# EAGLE schematic Led_Driver_90_B1 (EAGLE 6.4)
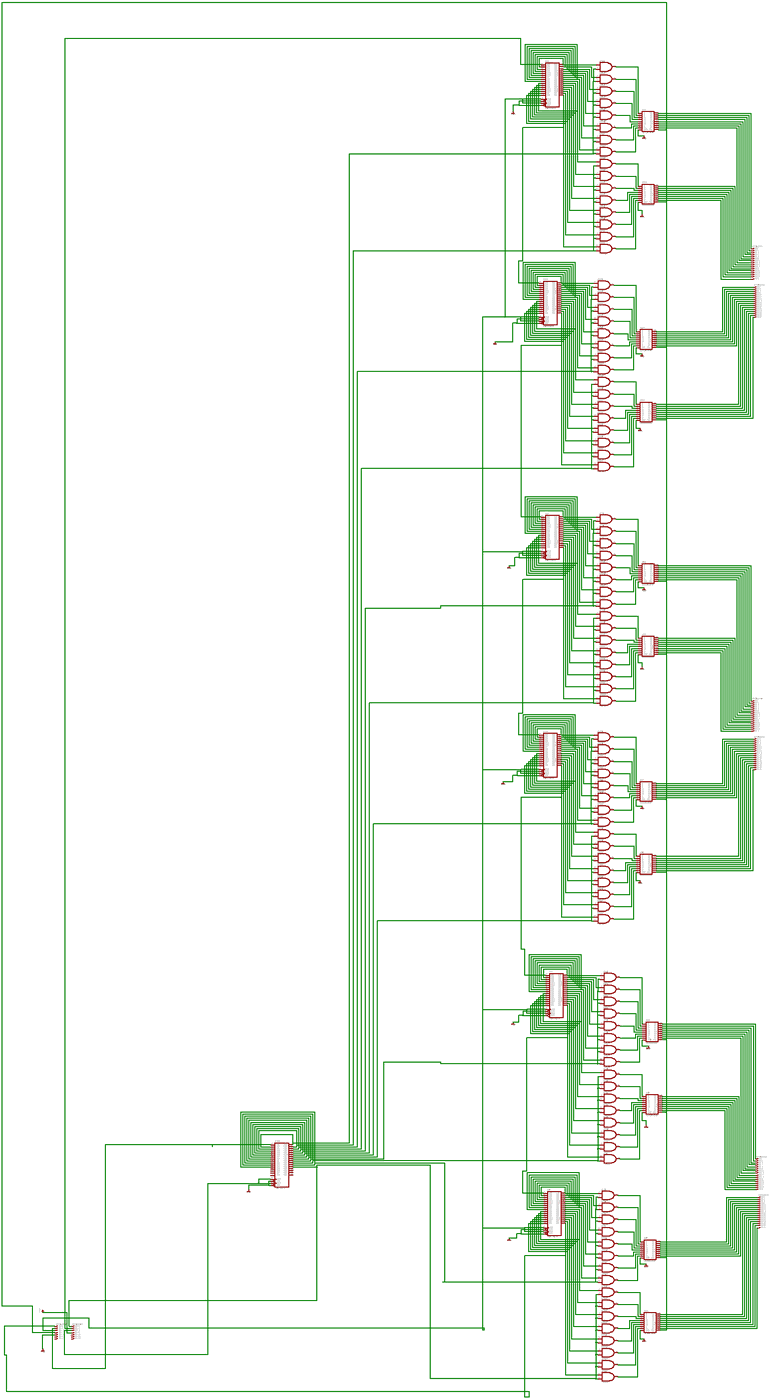
[diagram p0: schematic, sheet 1, overview]
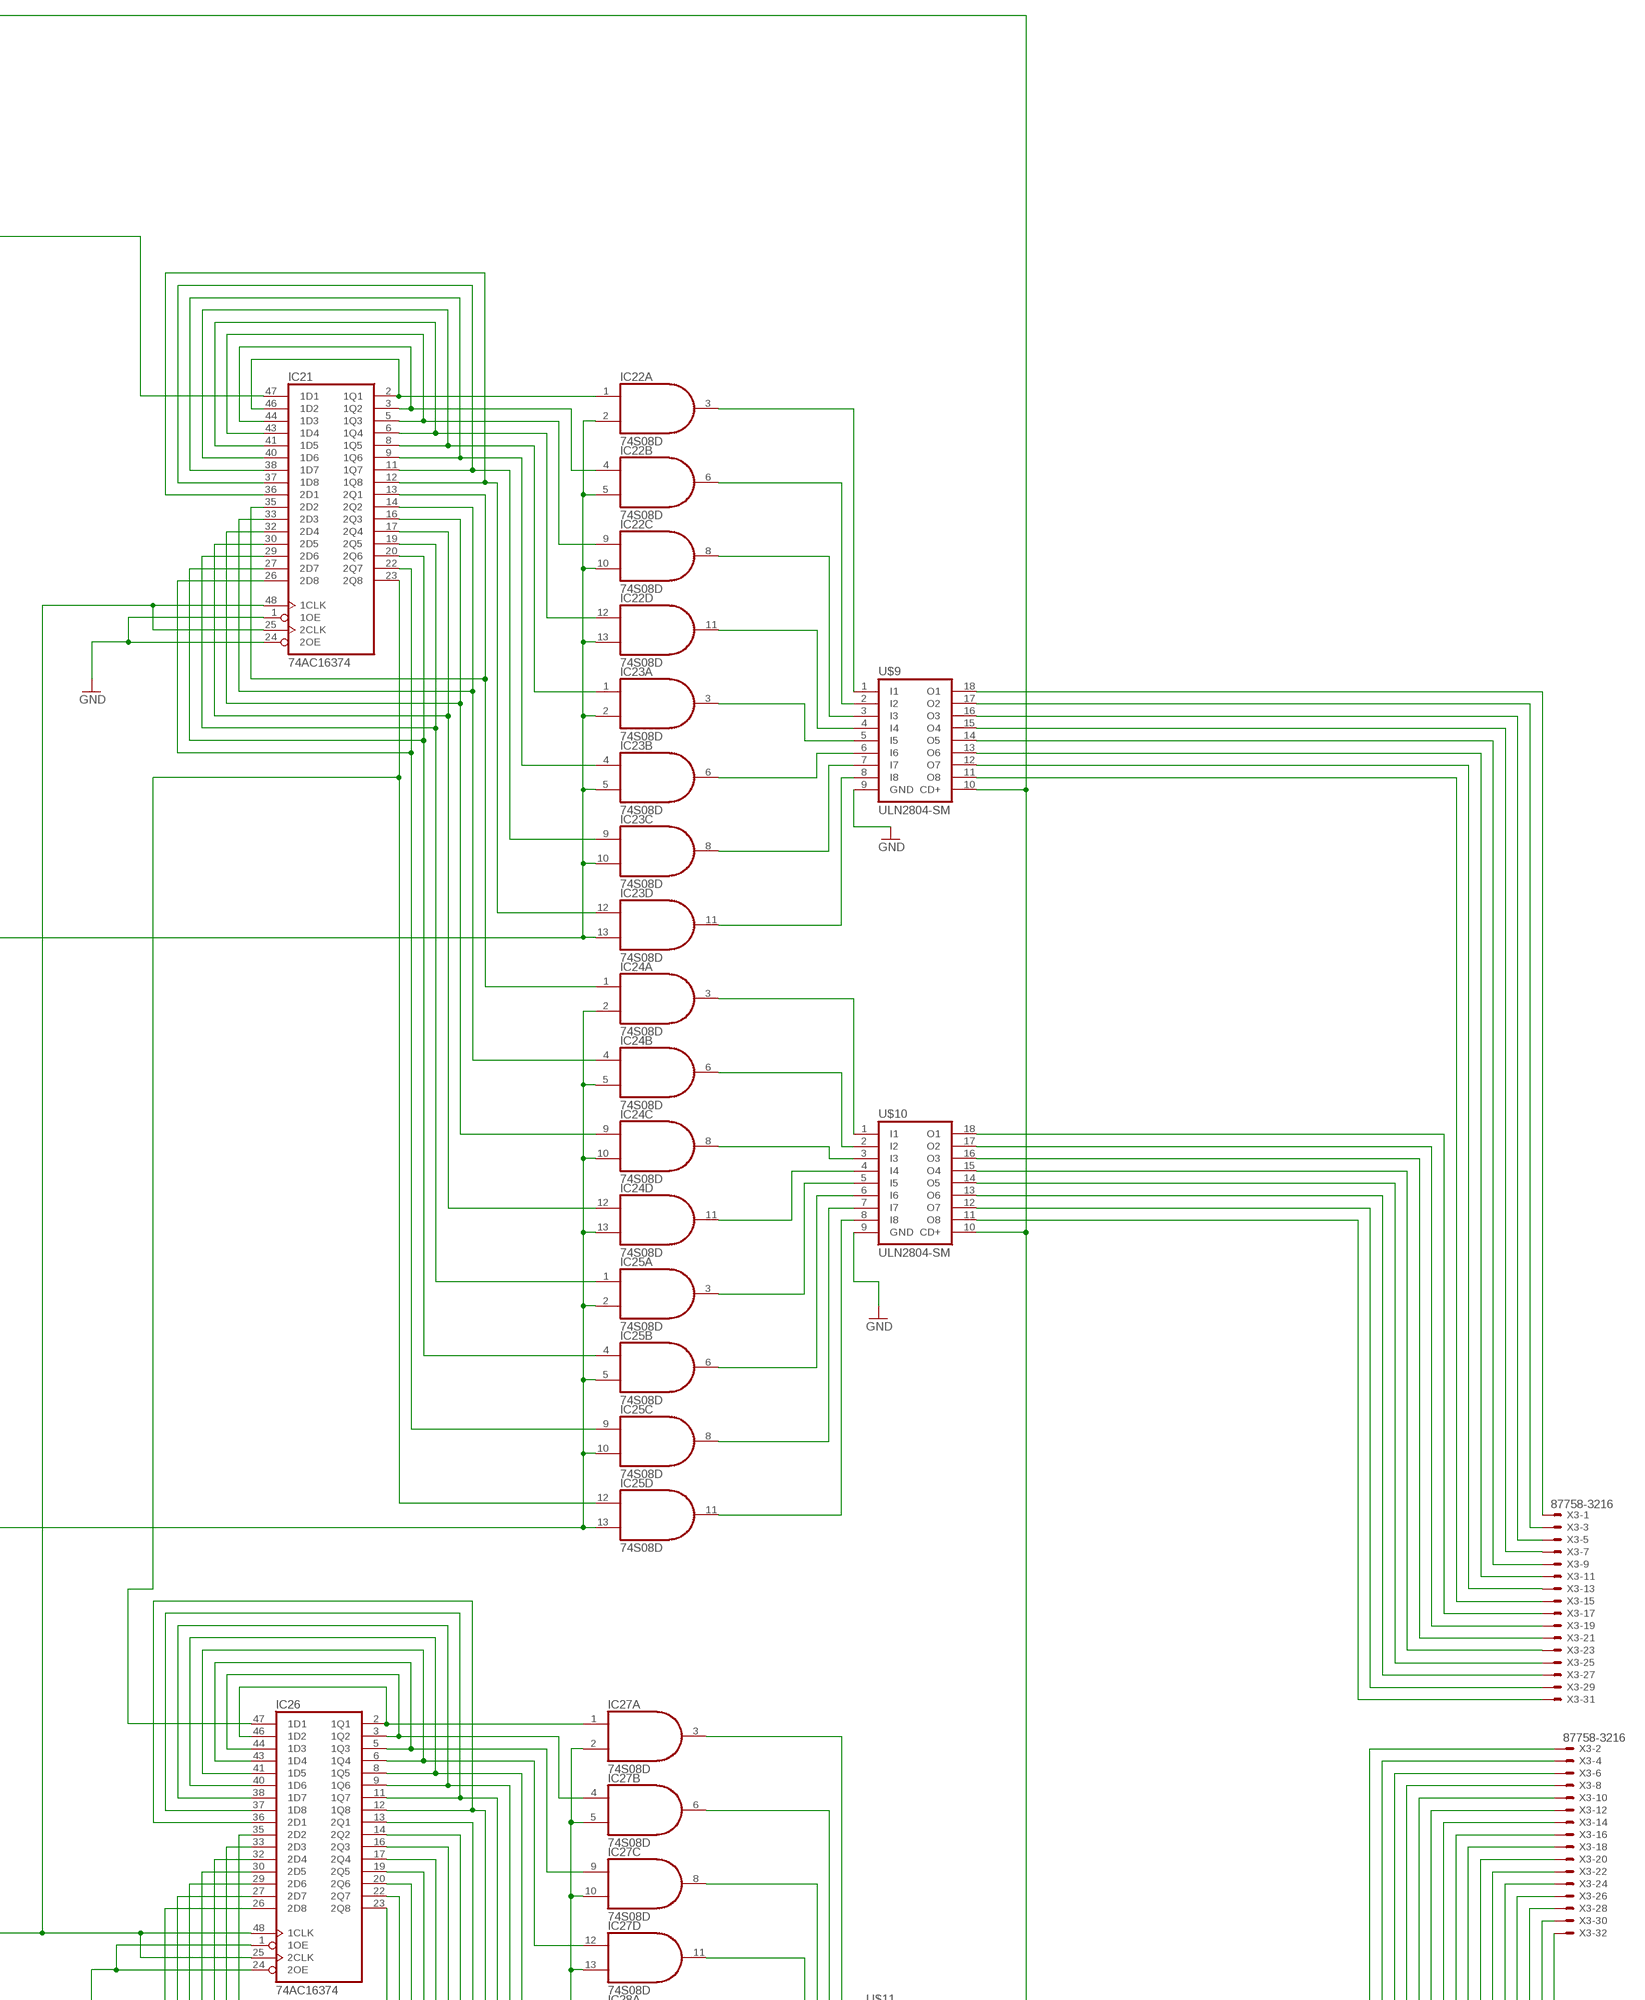
[diagram p1: schematic, sheet 1, part 1 of 9]
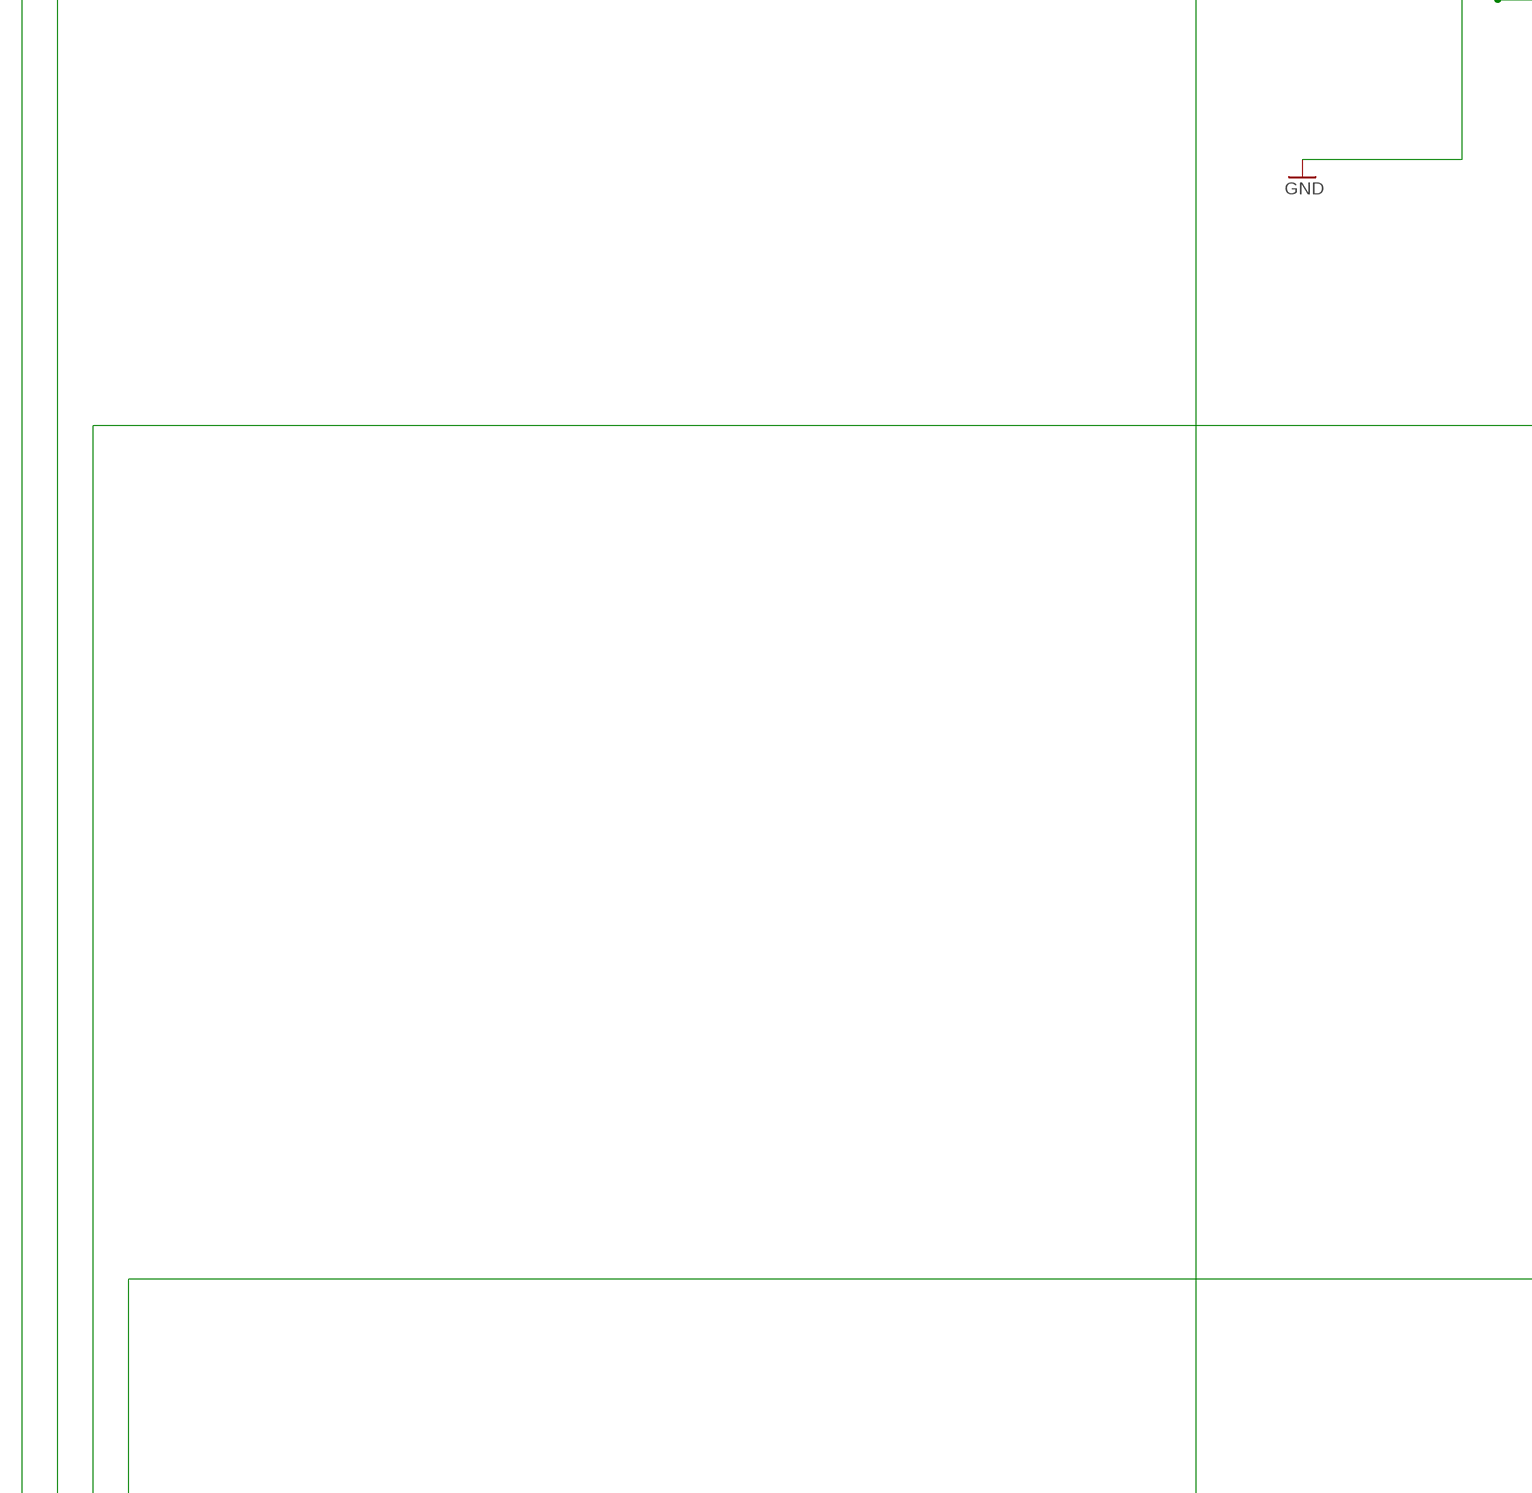
[diagram p2: schematic, sheet 1, part 2 of 9]
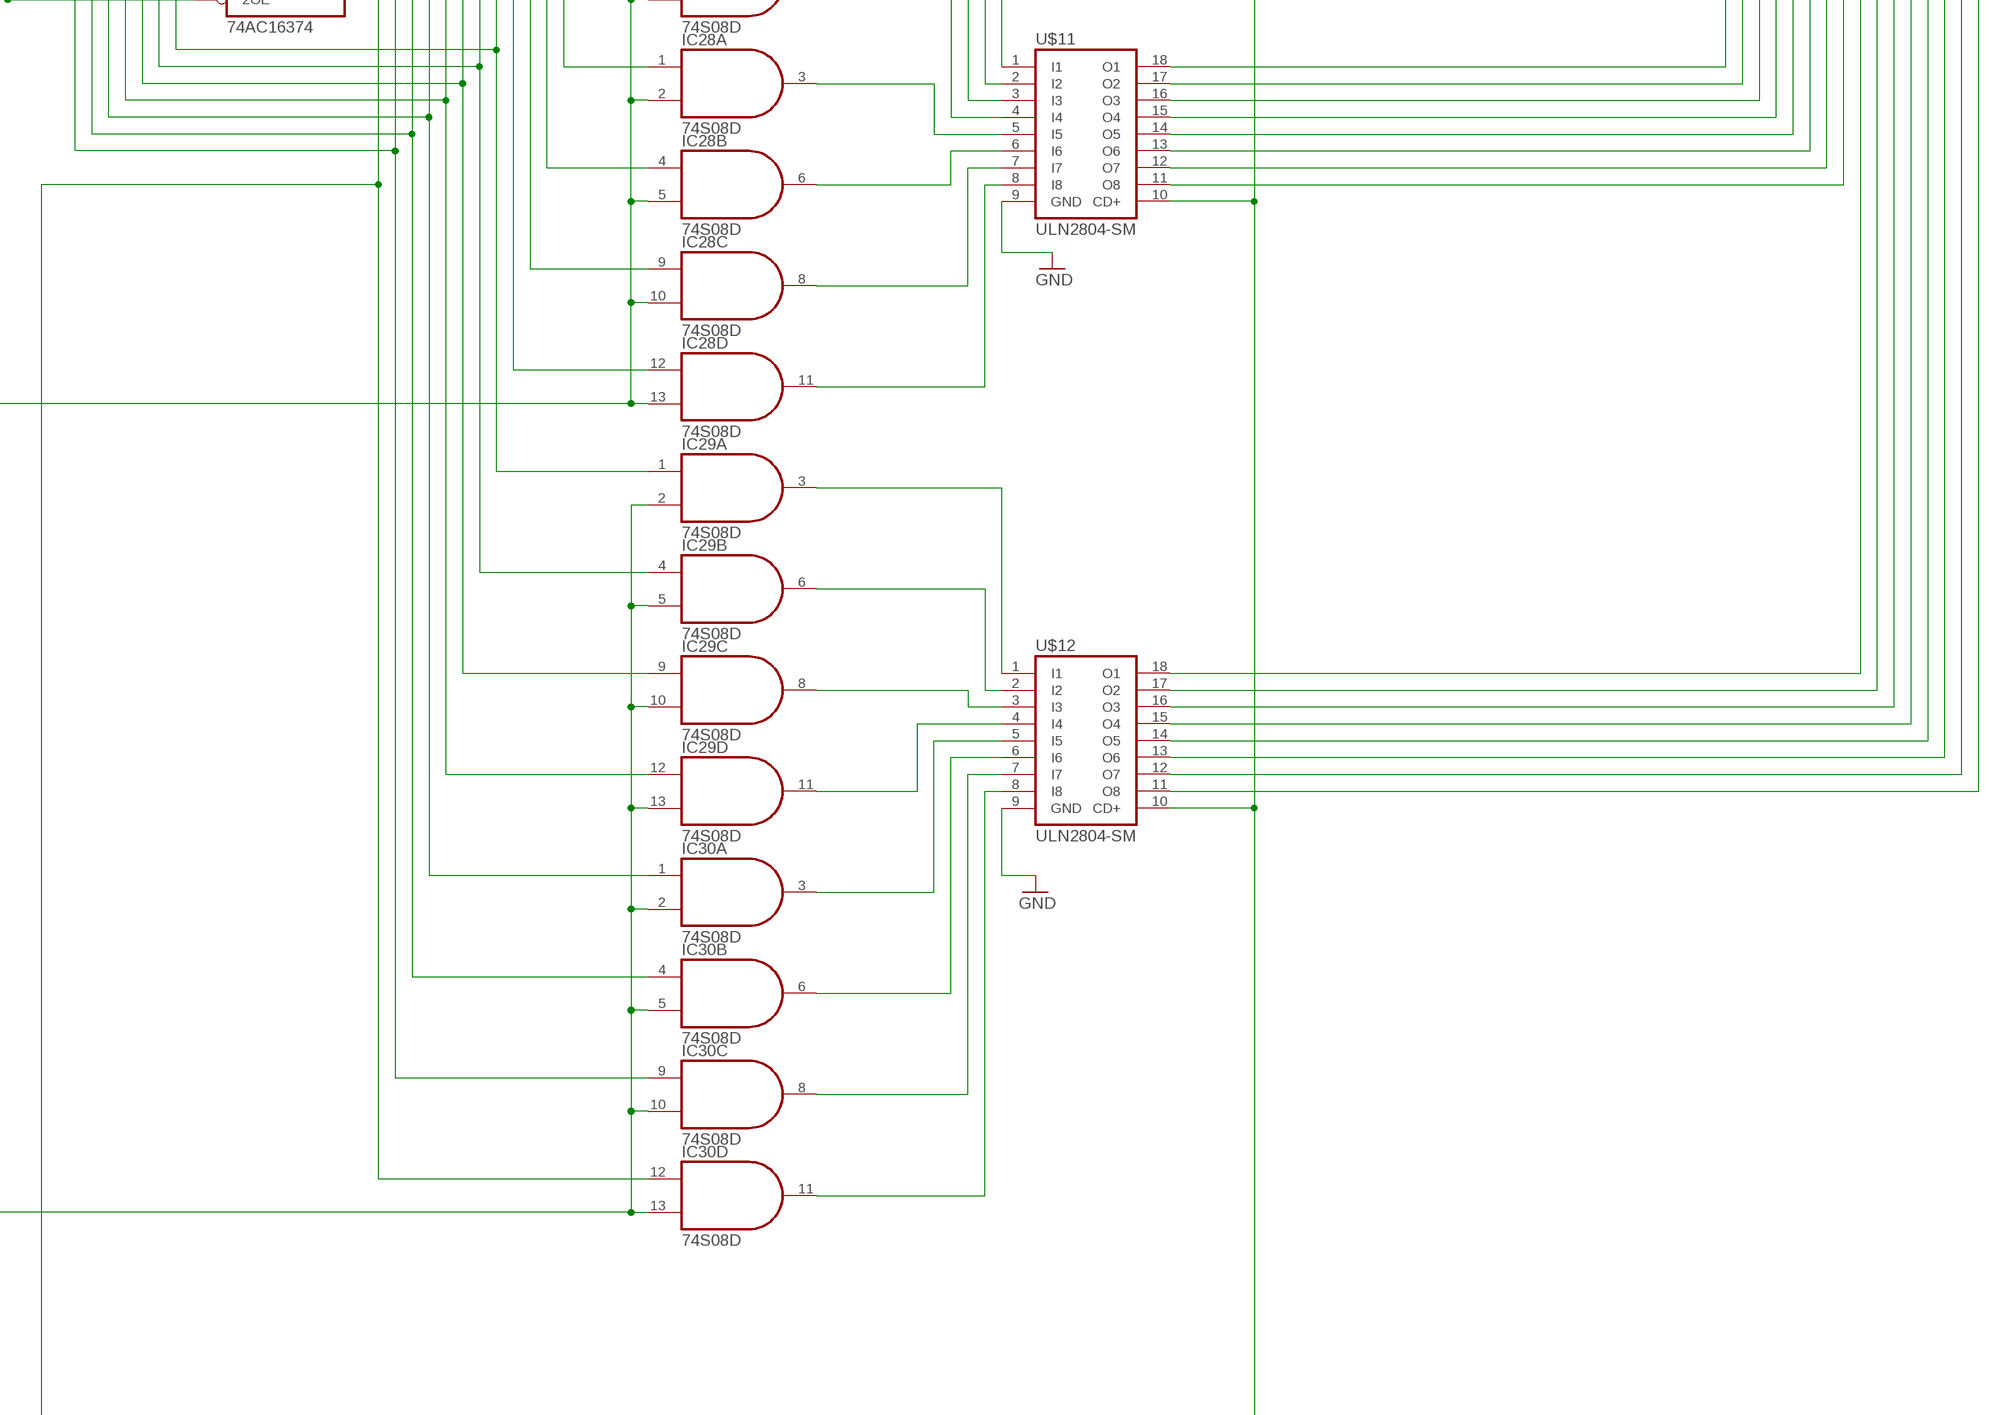
[diagram p3: schematic, sheet 1, part 3 of 9]
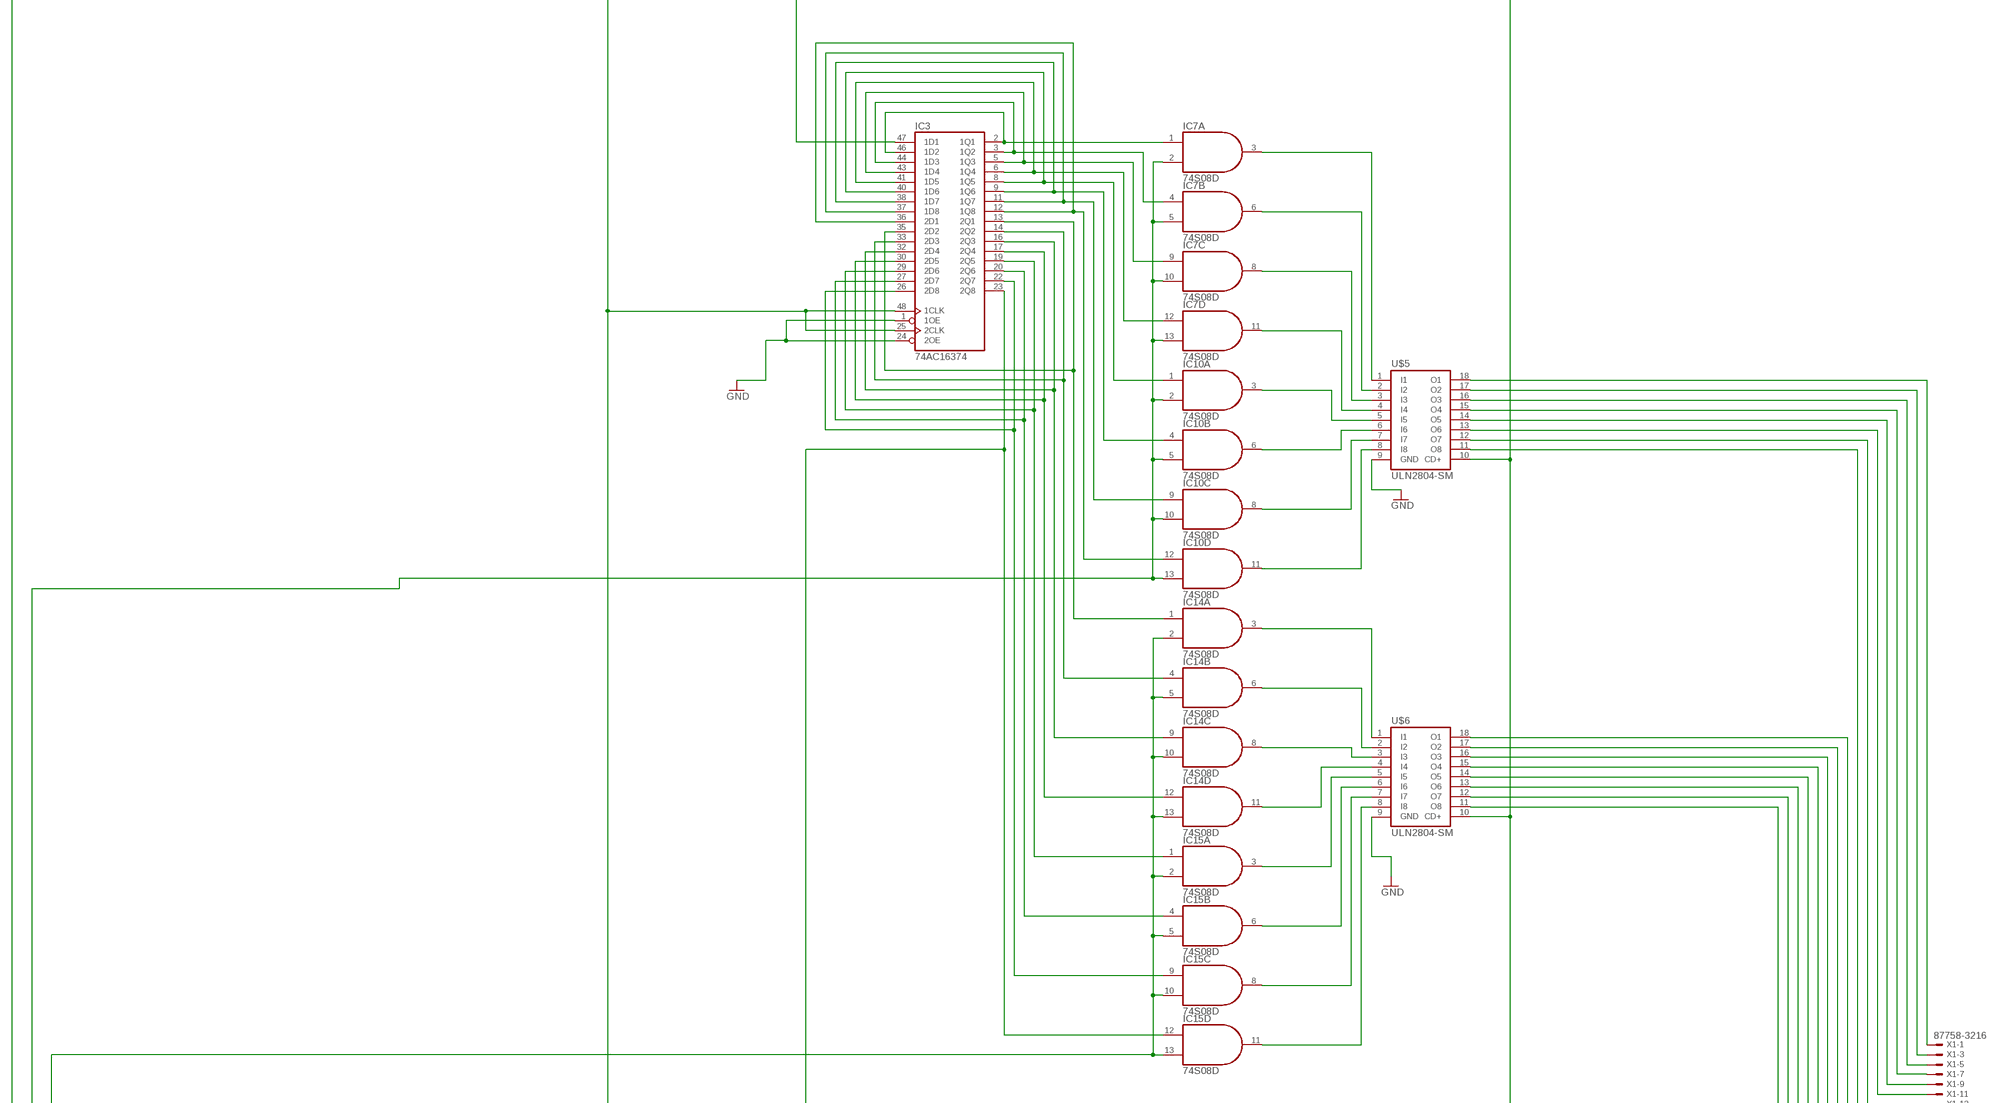
[diagram p4: schematic, sheet 1, part 4 of 9]
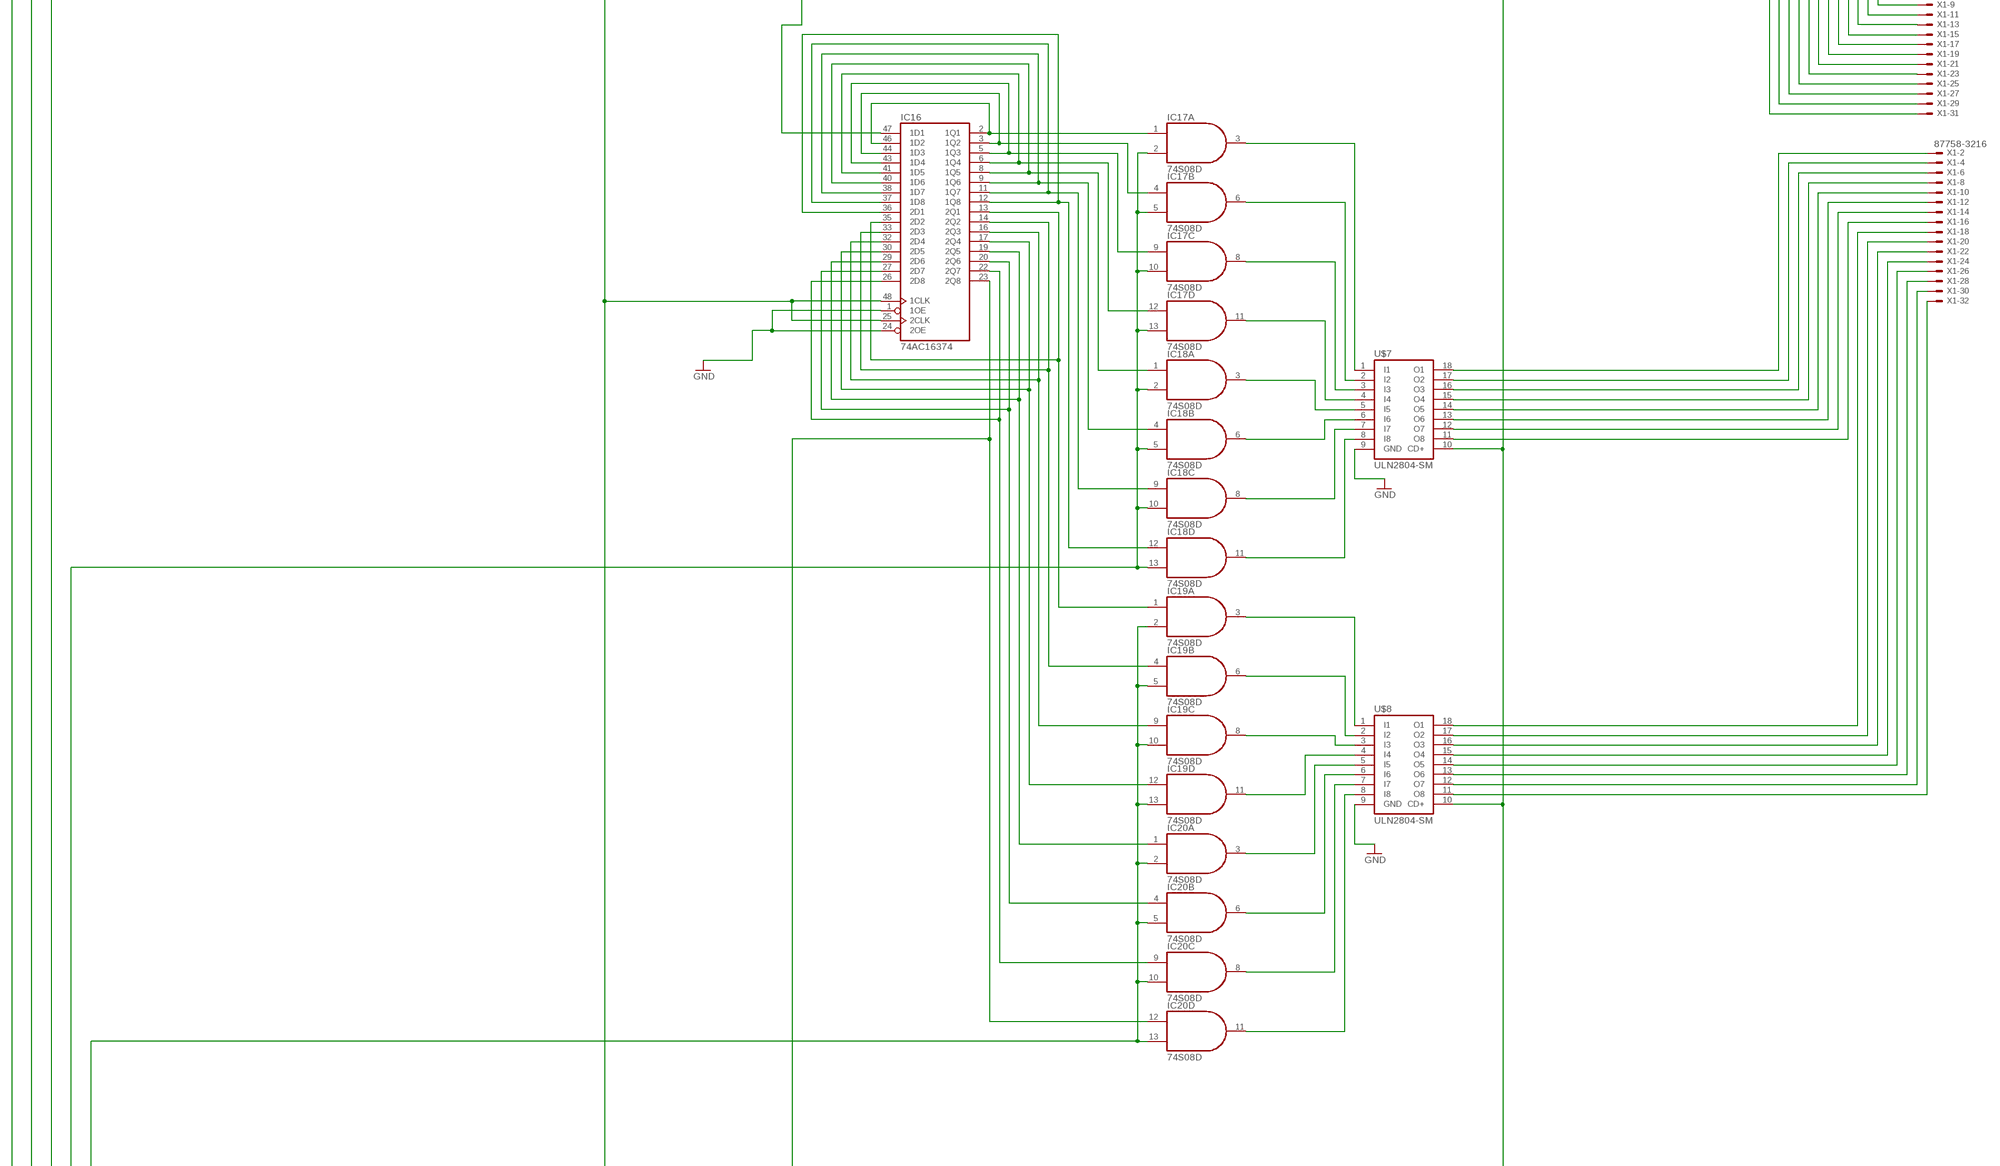
[diagram p5: schematic, sheet 1, part 5 of 9]
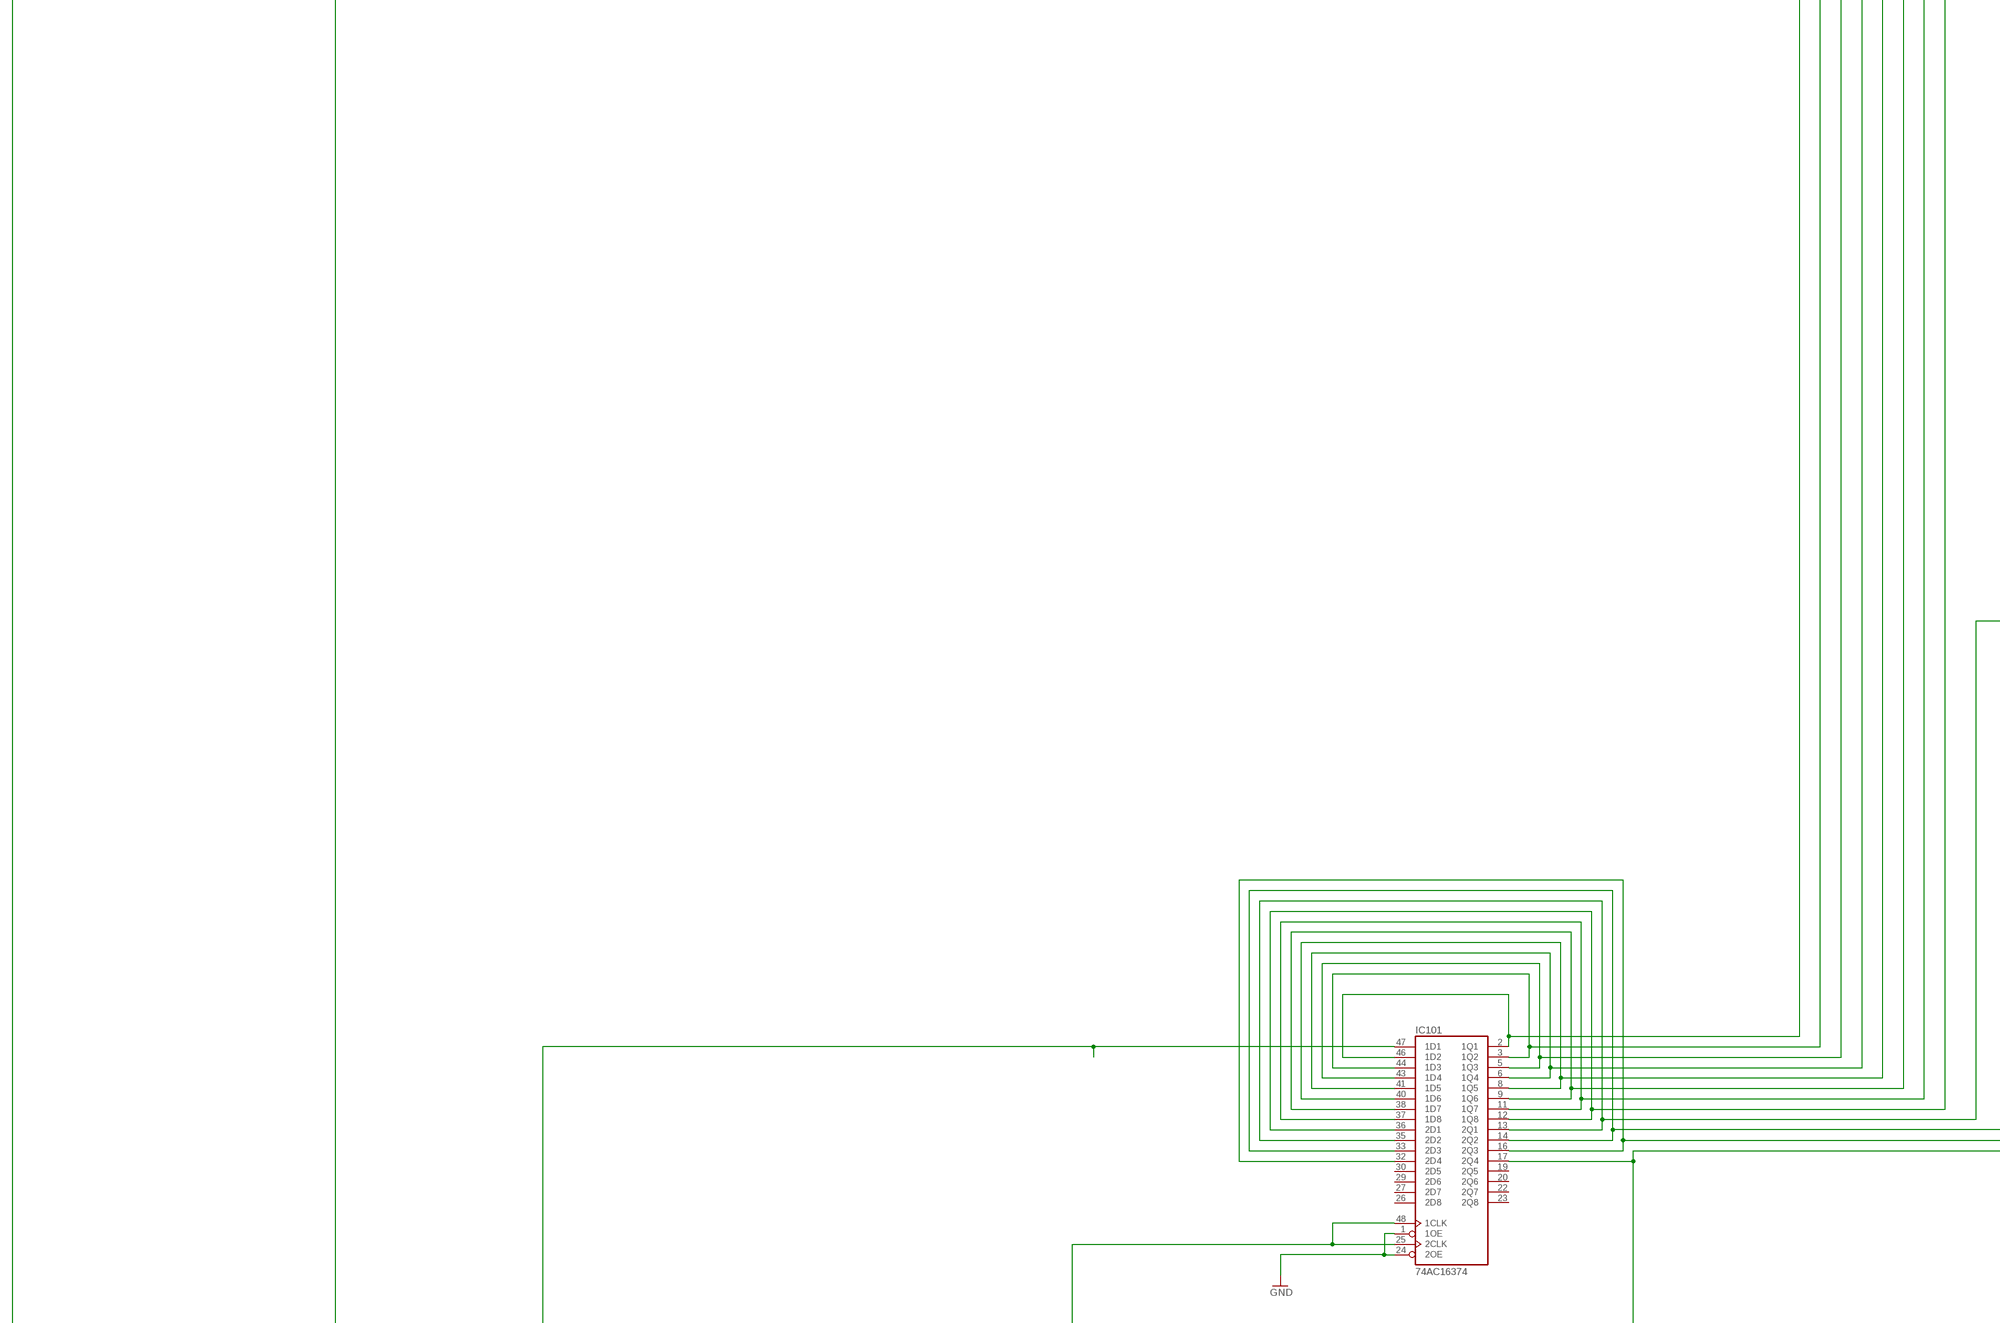
[diagram p6: schematic, sheet 1, part 6 of 9]
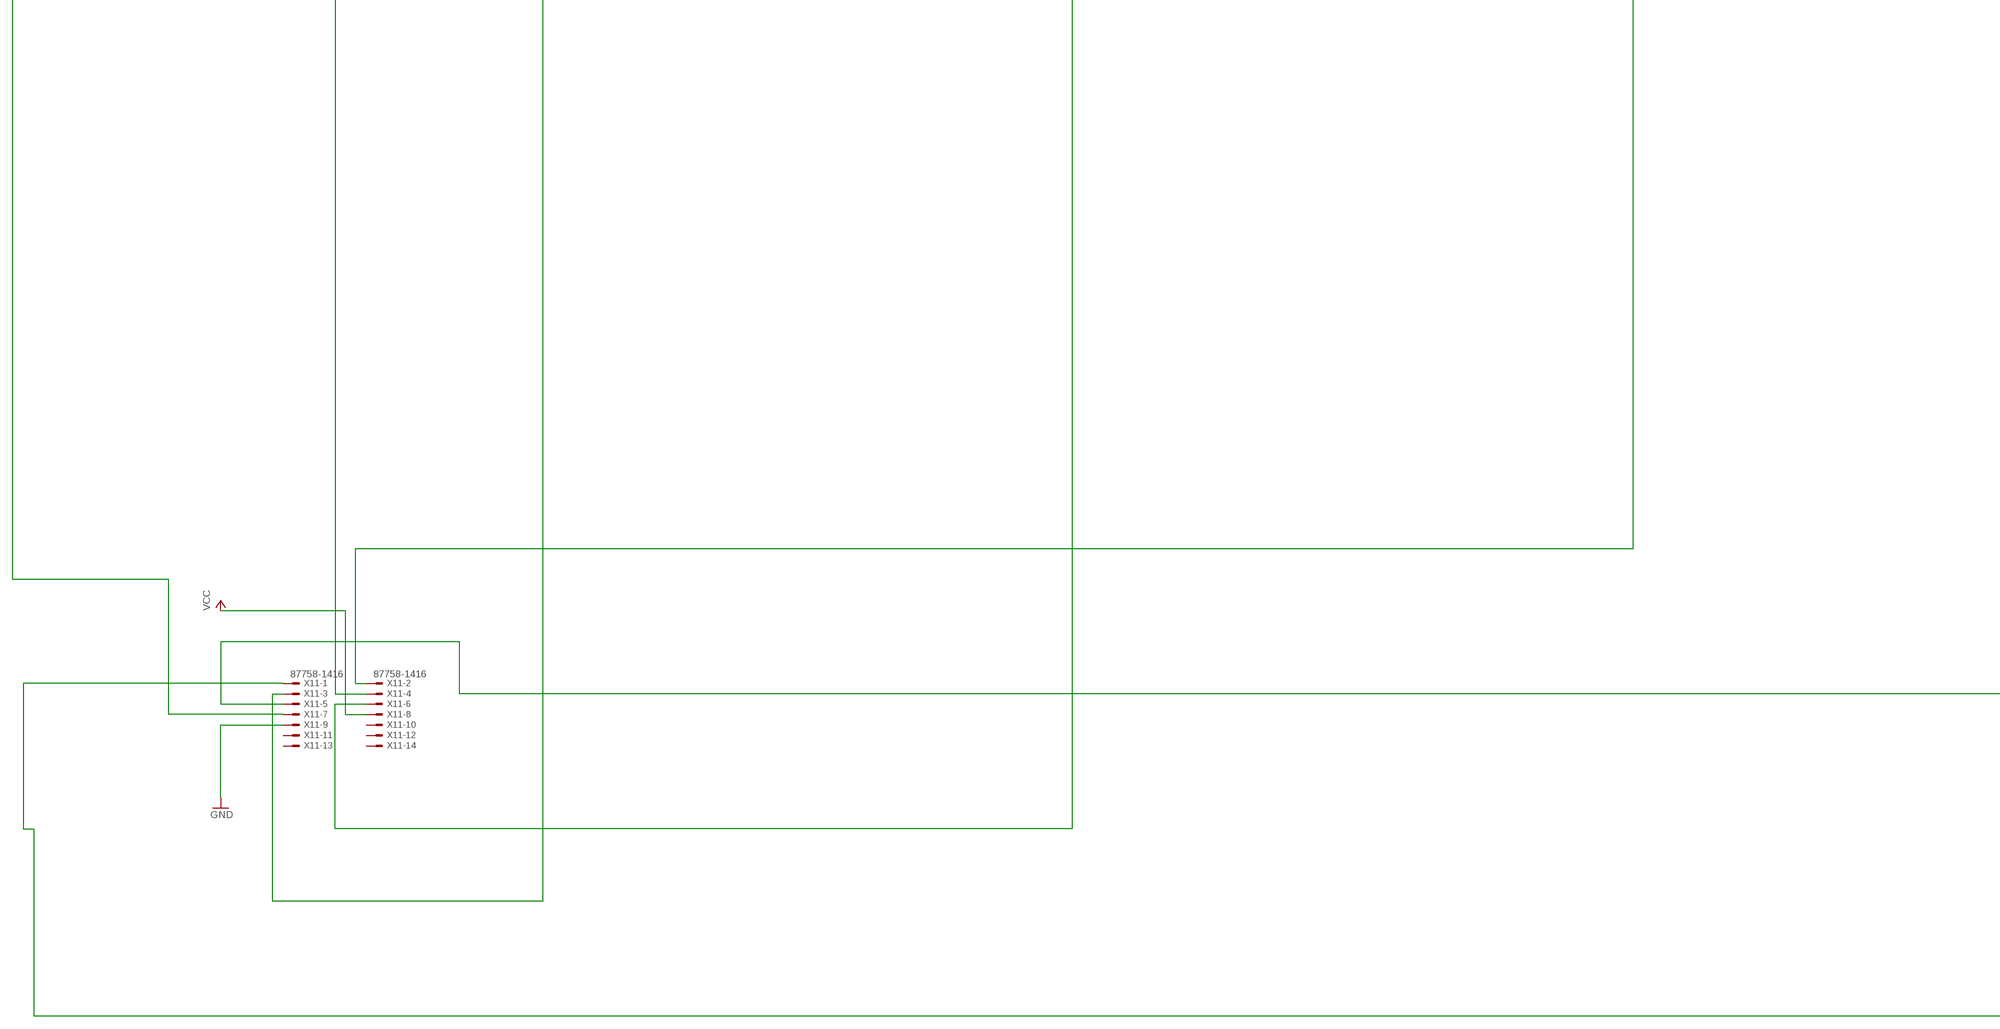
[diagram p7: schematic, sheet 1, part 7 of 9]
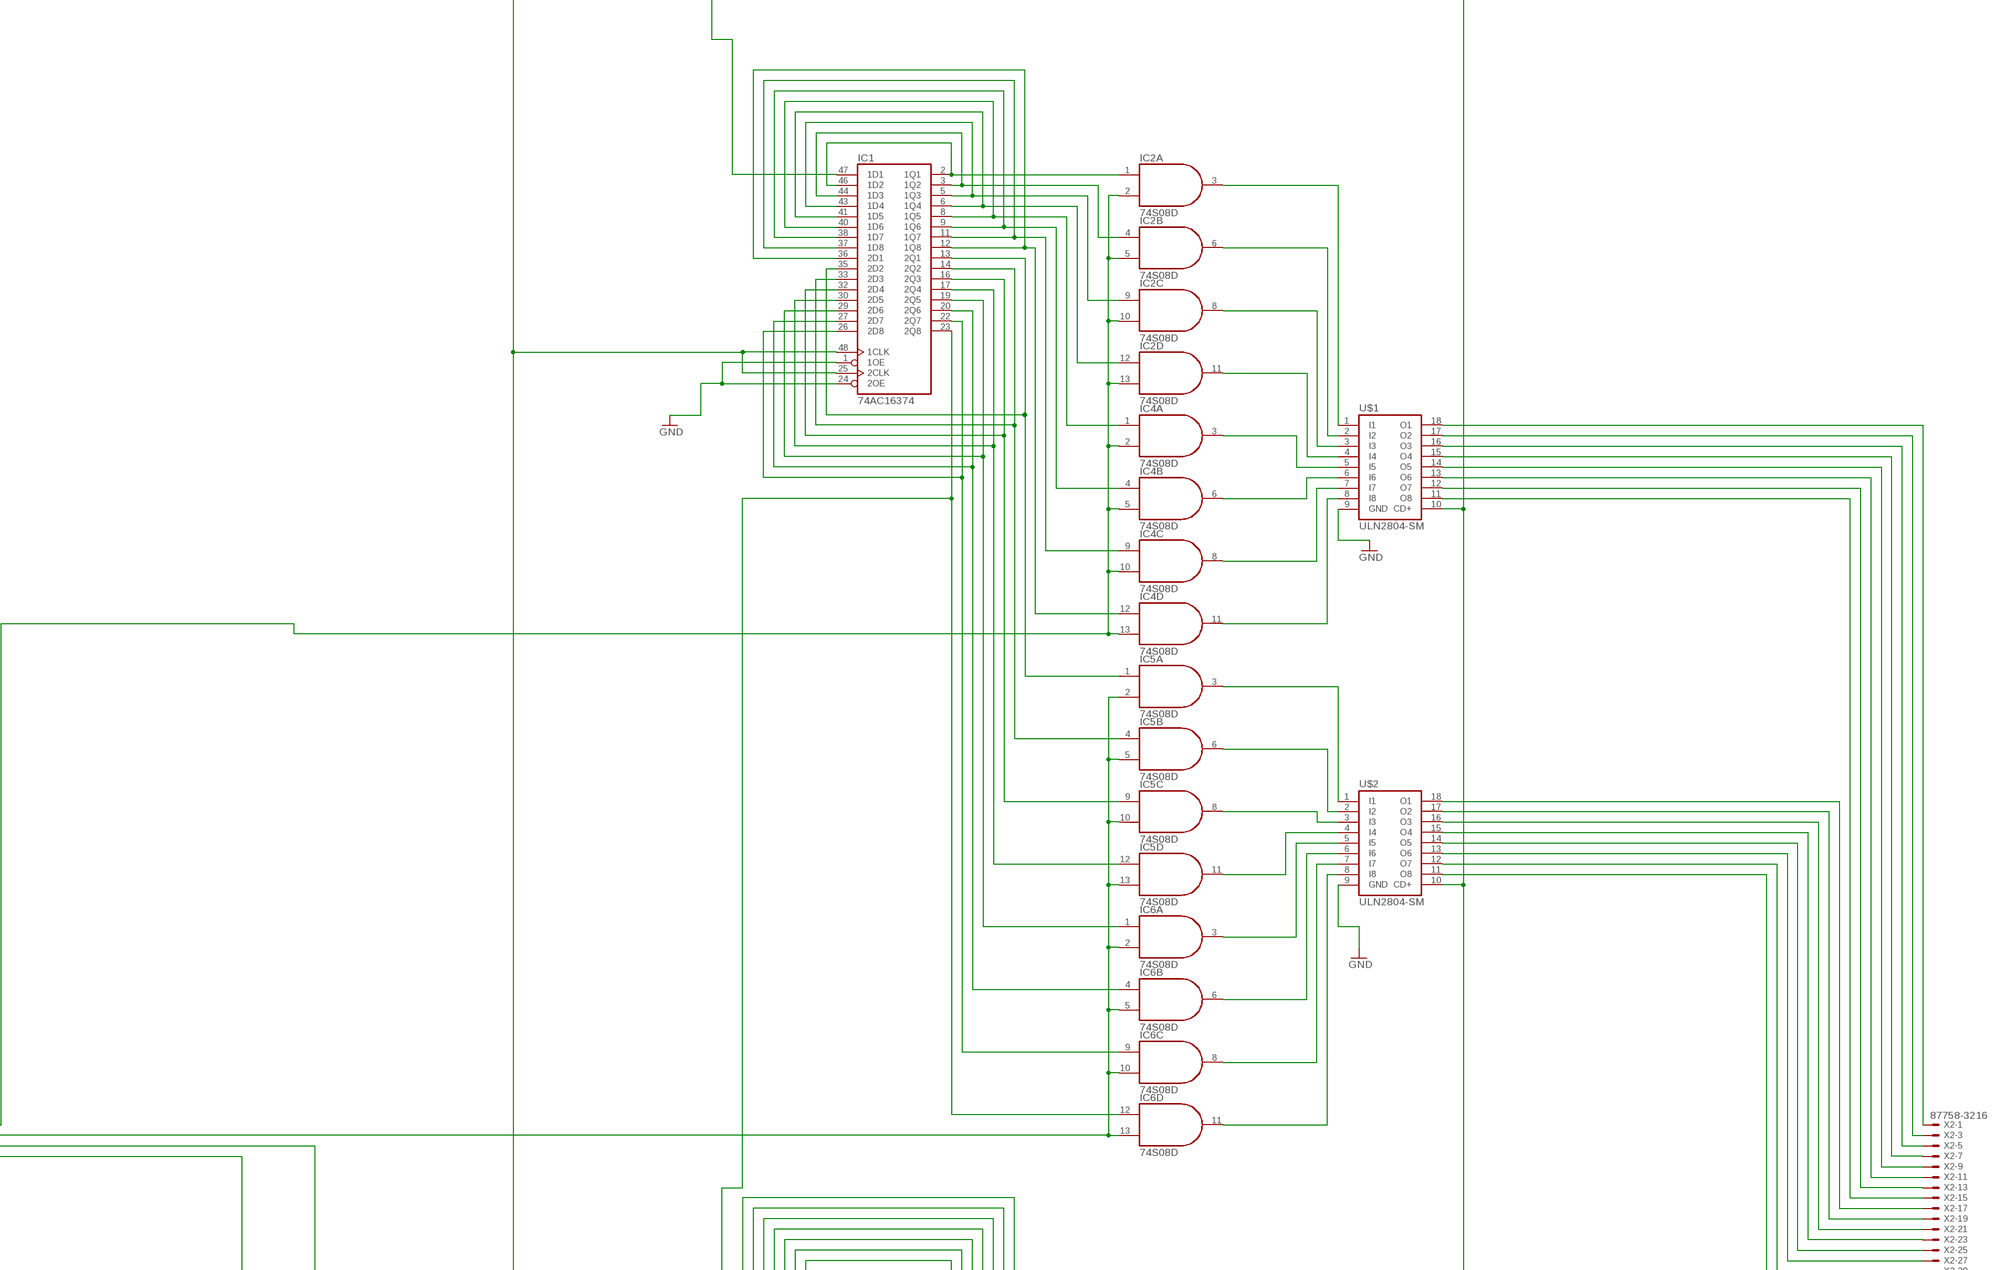
[diagram p8: schematic, sheet 1, part 8 of 9]
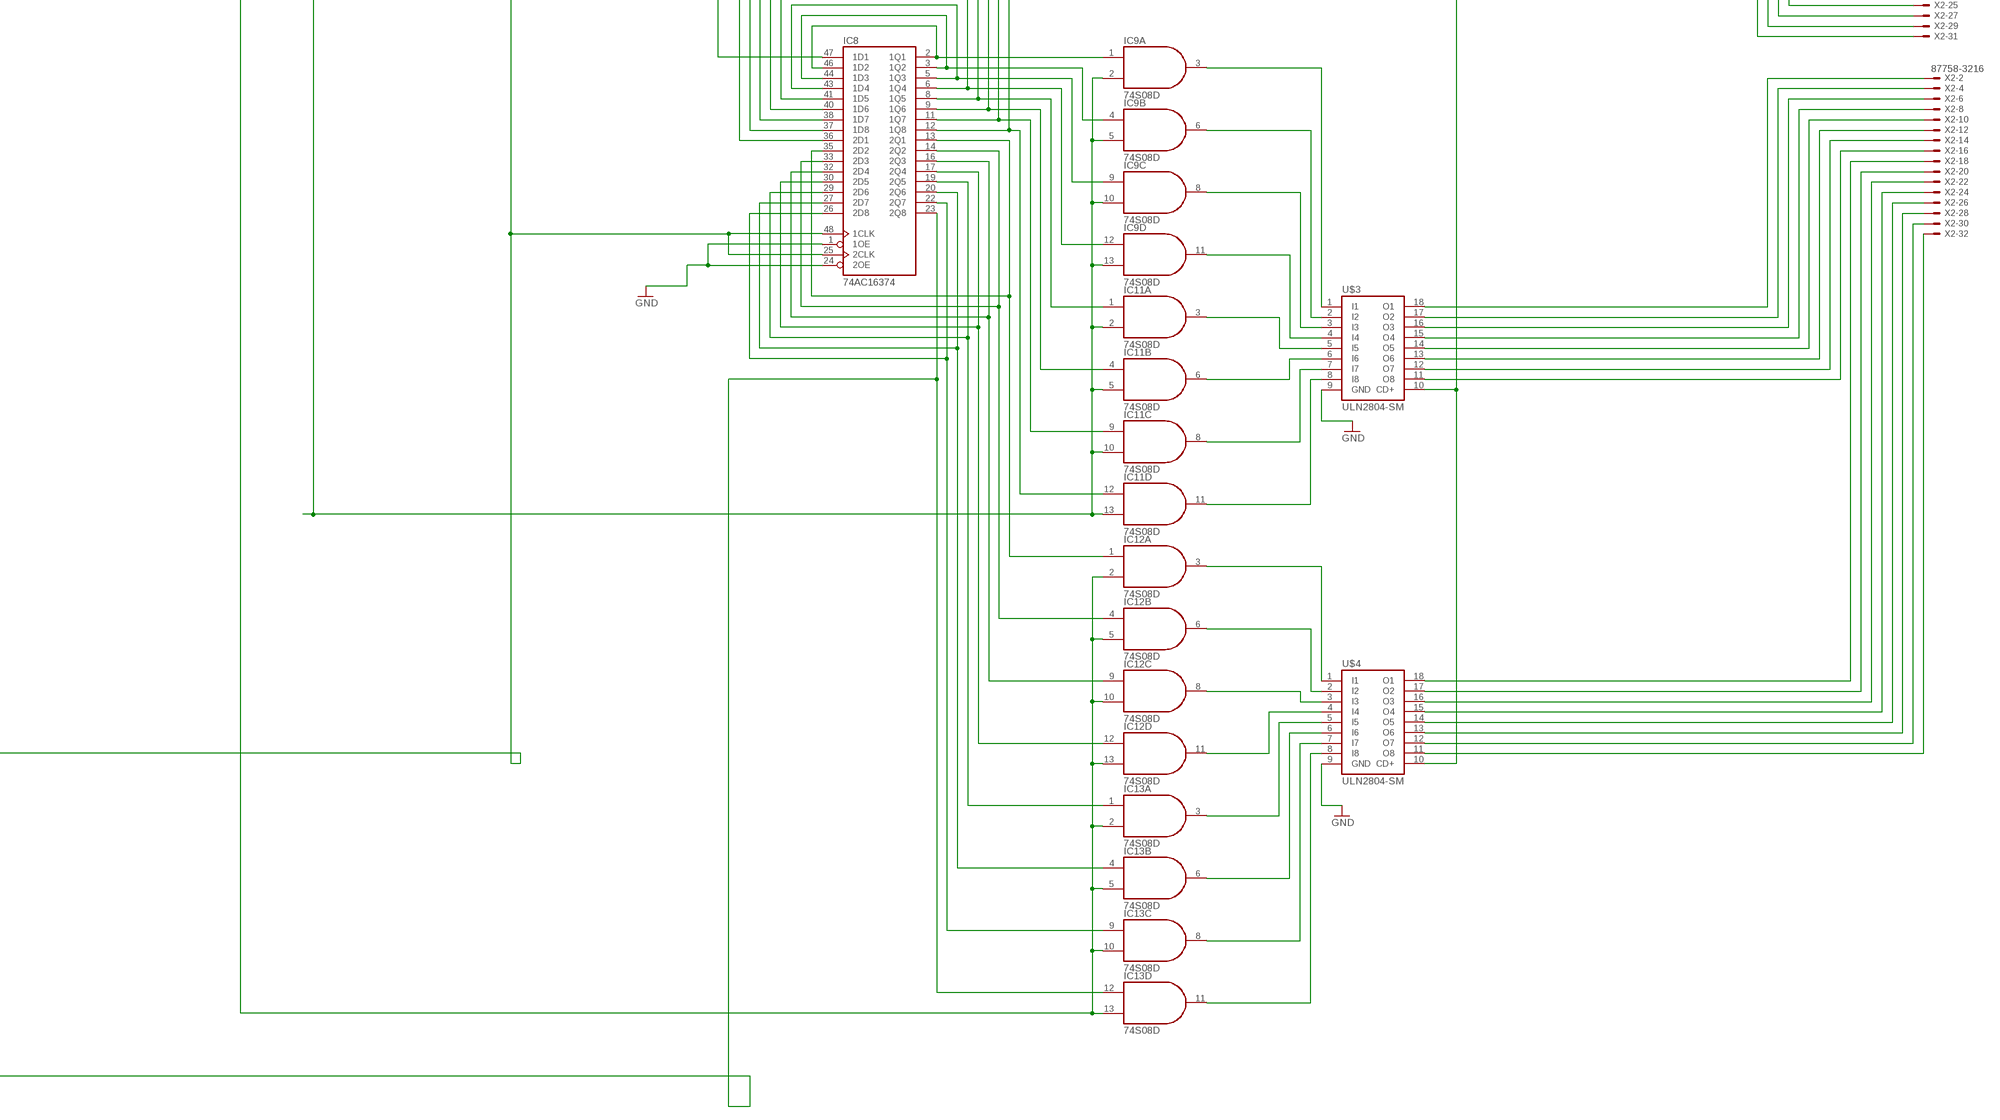
[diagram p9: schematic, sheet 1, part 9 of 9]

## Parts
IC1  74AC16374  [SSOP48DL]
IC2  74S08D  [SO14]
IC3  74AC16374  [SSOP48DL]
IC4  74S08D  [SO14]
IC5  74S08D  [SO14]
IC6  74S08D  [SO14]
IC7  74S08D  [SO14]
IC8  74AC16374  [SSOP48DL]
IC9  74S08D  [SO14]
IC10  74S08D  [SO14]
IC11  74S08D  [SO14]
IC12  74S08D  [SO14]
IC13  74S08D  [SO14]
IC14  74S08D  [SO14]
IC15  74S08D  [SO14]
IC16  74AC16374  [SSOP48DL]
IC17  74S08D  [SO14]
IC18  74S08D  [SO14]
IC19  74S08D  [SO14]
IC20  74S08D  [SO14]
IC21  74AC16374  [SSOP48DL]
IC22  74S08D  [SO14]
IC23  74S08D  [SO14]
IC24  74S08D  [SO14]
IC25  74S08D  [SO14]
IC26  74AC16374  [SSOP48DL]
IC27  74S08D  [SO14]
IC28  74S08D  [SO14]
IC29  74S08D  [SO14]
IC30  74S08D  [SO14]
IC101  74AC16374  [SSOP48DL]
U$1  ULN2804-SM  [SOP-18]
U$2  ULN2804-SM  [SOP-18]
U$3  ULN2804-SM  [SOP-18]
U$4  ULN2804-SM  [SOP-18]
U$5  ULN2804-SM  [SOP-18]
U$6  ULN2804-SM  [SOP-18]
U$7  ULN2804-SM  [SOP-18]
U$8  ULN2804-SM  [SOP-18]
U$9  ULN2804-SM  [SOP-18]
U$10  ULN2804-SM  [SOP-18]
U$11  ULN2804-SM  [SOP-18]
U$12  ULN2804-SM  [SOP-18]
X1  87758-3216  [87758-3216]
X2  87758-3216  [87758-3216]
X3  87758-3216  [87758-3216]
X11  87758-1416  [87758-1416]

## Nets
GND: IC1.1(1OE) IC1.24(2OE) IC3.1(1OE) IC3.24(2OE) IC8.1(1OE) IC8.24(2OE) IC16.1(1OE) IC16.24(2OE) IC21.1(1OE) IC21.24(2OE) IC26.1(1OE) IC26.24(2OE) IC101.1(1OE) IC101.24(2OE) U$1.9(GND) U$2.9(GND) U$3.9(GND) U$4.9(GND) U$5.9(GND) U$6.9(GND) U$7.9(GND) U$8.9(GND) U$9.9(GND) U$10.9(GND) U$11.9(GND) U$12.9(GND) X11.9
N$2: IC1.2(1Q1) IC1.46(1D2) IC2.1(A:I0)
N$3: IC1.3(1Q2) IC1.44(1D3) IC2.4(B:I0)
N$4: IC1.5(1Q3) IC1.43(1D4) IC2.9(C:I0)
N$5: IC1.6(1Q4) IC1.41(1D5) IC2.12(D:I0)
N$6: IC1.8(1Q5) IC1.40(1D6) IC4.1(A:I0)
N$7: IC1.9(1Q6) IC1.38(1D7) IC4.4(B:I0)
N$8: IC1.11(1Q7) IC1.37(1D8) IC4.9(C:I0)
N$9: IC1.12(1Q8) IC1.36(2D1) IC4.12(D:I0)
N$10: IC1.13(2Q1) IC1.35(2D2) IC5.1(A:I0)
N$11: IC1.14(2Q2) IC1.33(2D3) IC5.4(B:I0)
N$12: IC1.16(2Q3) IC1.32(2D4) IC5.9(C:I0)
N$13: IC1.17(2Q4) IC1.30(2D5) IC5.12(D:I0)
N$14: IC1.19(2Q5) IC1.29(2D6) IC6.1(A:I0)
N$15: IC1.20(2Q6) IC1.27(2D7) IC6.4(B:I0)
N$16: IC1.22(2Q7) IC1.26(2D8) IC6.9(C:I0)
N$17: U$1.18(O1) X2.1
N$19: IC2.3(A:O) U$1.1(I1)
N$20: IC2.6(B:O) U$1.2(I2)
N$21: IC2.8(C:O) U$1.3(I3)
N$22: IC2.11(D:O) U$1.4(I4)
N$23: IC4.3(A:O) U$1.5(I5)
N$24: IC4.11(D:O) U$1.8(I8)
N$25: IC4.8(C:O) U$1.7(I7)
N$26: IC4.6(B:O) U$1.6(I6)
N$27: IC5.3(A:O) U$2.1(I1)
N$28: IC5.6(B:O) U$2.2(I2)
N$29: IC5.8(C:O) U$2.3(I3)
N$30: IC6.11(D:O) U$2.8(I8)
N$31: IC6.8(C:O) U$2.7(I7)
N$32: IC6.6(B:O) U$2.6(I6)
N$33: IC6.3(A:O) U$2.5(I5)
N$34: IC5.11(D:O) U$2.4(I4)
N$35: IC22.2(A:I1) IC22.5(B:I1) IC22.10(C:I1) IC22.13(D:I1) IC23.2(A:I1) IC23.5(B:I1) IC23.10(C:I1) IC23.13(D:I1) IC101.2(1Q1) IC101.46(1D2)
N$36: IC24.2(A:I1) IC24.5(B:I1) IC24.10(C:I1) IC24.13(D:I1) IC25.2(A:I1) IC25.5(B:I1) IC25.10(C:I1) IC25.13(D:I1) IC101.3(1Q2) IC101.44(1D3)
N$39: IC8.2(1Q1) IC8.46(1D2) IC9.1(A:I0)
N$40: IC8.3(1Q2) IC8.44(1D3) IC9.4(B:I0)
N$41: IC8.5(1Q3) IC8.43(1D4) IC9.9(C:I0)
N$42: IC8.6(1Q4) IC8.41(1D5) IC9.12(D:I0)
N$43: IC8.8(1Q5) IC8.40(1D6) IC11.1(A:I0)
N$44: IC8.9(1Q6) IC8.38(1D7) IC11.4(B:I0)
N$45: IC8.11(1Q7) IC8.37(1D8) IC11.9(C:I0)
N$46: IC8.12(1Q8) IC8.36(2D1) IC11.12(D:I0)
N$47: IC8.13(2Q1) IC8.35(2D2) IC12.1(A:I0)
N$48: IC8.14(2Q2) IC8.33(2D3) IC12.4(B:I0)
N$49: IC8.16(2Q3) IC8.32(2D4) IC12.9(C:I0)
N$50: IC8.17(2Q4) IC8.30(2D5) IC12.12(D:I0)
N$51: IC8.19(2Q5) IC8.29(2D6) IC13.1(A:I0)
N$52: IC8.20(2Q6) IC8.27(2D7) IC13.4(B:I0)
N$53: IC8.22(2Q7) IC8.26(2D8) IC13.9(C:I0)
N$56: IC9.3(A:O) U$3.1(I1)
N$57: IC9.6(B:O) U$3.2(I2)
N$58: IC9.8(C:O) U$3.3(I3)
N$59: IC9.11(D:O) U$3.4(I4)
N$60: IC11.3(A:O) U$3.5(I5)
N$61: IC11.11(D:O) U$3.8(I8)
N$62: IC11.8(C:O) U$3.7(I7)
N$63: IC11.6(B:O) U$3.6(I6)
N$64: IC12.3(A:O) U$4.1(I1)
N$65: IC12.6(B:O) U$4.2(I2)
N$66: IC12.8(C:O) U$4.3(I3)
N$67: IC13.11(D:O) U$4.8(I8)
N$68: IC13.8(C:O) U$4.7(I7)
N$69: IC13.6(B:O) U$4.6(I6)
N$70: IC13.3(A:O) U$4.5(I5)
N$71: IC12.11(D:O) U$4.4(I4)
N$72: IC1.23(2Q8) IC6.12(D:I0) IC8.47(1D1)
N$75: U$1.17(O2) X2.3
N$76: U$1.16(O3) X2.5
N$77: U$1.15(O4) X2.7
N$78: U$1.14(O5) X2.9
N$79: U$1.13(O6) X2.11
N$80: U$1.12(O7) X2.13
N$81: U$1.11(O8) X2.15
N$82: U$2.18(O1) X2.17
N$83: U$2.17(O2) X2.19
N$84: U$2.16(O3) X2.21
N$85: U$2.15(O4) X2.23
N$86: U$2.14(O5) X2.25
N$87: U$2.13(O6) X2.27
N$88: U$2.12(O7) X2.29
N$89: U$2.11(O8) X2.31
N$90: U$4.11(O8) X2.32
N$91: U$4.12(O7) X2.30
N$92: U$4.13(O6) X2.28
N$93: U$4.14(O5) X2.26
N$94: U$4.15(O4) X2.24
N$95: U$4.16(O3) X2.22
N$96: U$4.17(O2) X2.20
N$97: U$4.18(O1) X2.18
N$98: U$3.11(O8) X2.16
N$99: U$3.12(O7) X2.14
N$100: U$3.13(O6) X2.12
N$101: U$3.14(O5) X2.10
N$102: U$3.15(O4) X2.8
N$103: U$3.16(O3) X2.6
N$104: U$3.17(O2) X2.4
N$105: U$3.18(O1) X2.2
N$107: IC3.2(1Q1) IC3.46(1D2) IC7.1(A:I0)
N$108: IC3.3(1Q2) IC3.44(1D3) IC7.4(B:I0)
N$109: IC3.5(1Q3) IC3.43(1D4) IC7.9(C:I0)
N$110: IC3.6(1Q4) IC3.41(1D5) IC7.12(D:I0)
N$111: IC3.8(1Q5) IC3.40(1D6) IC10.1(A:I0)
N$112: IC3.9(1Q6) IC3.38(1D7) IC10.4(B:I0)
N$113: IC3.11(1Q7) IC3.37(1D8) IC10.9(C:I0)
N$114: IC3.12(1Q8) IC3.36(2D1) IC10.12(D:I0)
N$115: IC3.13(2Q1) IC3.35(2D2) IC14.1(A:I0)
N$116: IC3.14(2Q2) IC3.33(2D3) IC14.4(B:I0)
N$117: IC3.16(2Q3) IC3.32(2D4) IC14.9(C:I0)
N$118: IC3.17(2Q4) IC3.30(2D5) IC14.12(D:I0)
N$119: IC3.19(2Q5) IC3.29(2D6) IC15.1(A:I0)
N$120: IC3.20(2Q6) IC3.27(2D7) IC15.4(B:I0)
N$121: IC3.22(2Q7) IC3.26(2D8) IC15.9(C:I0)
N$123: IC7.3(A:O) U$5.1(I1)
N$124: IC7.6(B:O) U$5.2(I2)
N$125: IC7.8(C:O) U$5.3(I3)
N$126: IC7.11(D:O) U$5.4(I4)
N$127: IC10.3(A:O) U$5.5(I5)
N$128: IC10.11(D:O) U$5.8(I8)
N$129: IC10.8(C:O) U$5.7(I7)
N$130: IC10.6(B:O) U$5.6(I6)
N$131: IC14.3(A:O) U$6.1(I1)
N$132: IC14.6(B:O) U$6.2(I2)
N$133: IC14.8(C:O) U$6.3(I3)
N$134: IC15.11(D:O) U$6.8(I8)
N$135: IC15.8(C:O) U$6.7(I7)
N$136: IC15.6(B:O) U$6.6(I6)
N$137: IC15.3(A:O) U$6.5(I5)
N$138: IC14.11(D:O) U$6.4(I4)
N$143: IC16.2(1Q1) IC16.46(1D2) IC17.1(A:I0)
N$144: IC16.3(1Q2) IC16.44(1D3) IC17.4(B:I0)
N$145: IC16.5(1Q3) IC16.43(1D4) IC17.9(C:I0)
N$146: IC16.6(1Q4) IC16.41(1D5) IC17.12(D:I0)
N$147: IC16.8(1Q5) IC16.40(1D6) IC18.1(A:I0)
N$148: IC16.9(1Q6) IC16.38(1D7) IC18.4(B:I0)
N$149: IC16.11(1Q7) IC16.37(1D8) IC18.9(C:I0)
N$150: IC16.12(1Q8) IC16.36(2D1) IC18.12(D:I0)
N$151: IC16.13(2Q1) IC16.35(2D2) IC19.1(A:I0)
N$152: IC16.14(2Q2) IC16.33(2D3) IC19.4(B:I0)
N$153: IC16.16(2Q3) IC16.32(2D4) IC19.9(C:I0)
N$154: IC16.17(2Q4) IC16.30(2D5) IC19.12(D:I0)
N$155: IC16.19(2Q5) IC16.29(2D6) IC20.1(A:I0)
N$156: IC16.20(2Q6) IC16.27(2D7) IC20.4(B:I0)
N$157: IC16.22(2Q7) IC16.26(2D8) IC20.9(C:I0)
N$158: IC1.47(1D1) IC16.23(2Q8) IC20.12(D:I0)
N$160: IC17.3(A:O) U$7.1(I1)
N$161: IC17.6(B:O) U$7.2(I2)
N$162: IC17.8(C:O) U$7.3(I3)
N$163: IC17.11(D:O) U$7.4(I4)
N$164: IC18.3(A:O) U$7.5(I5)
N$165: IC18.11(D:O) U$7.8(I8)
N$166: IC18.8(C:O) U$7.7(I7)
N$167: IC18.6(B:O) U$7.6(I6)
N$168: IC19.3(A:O) U$8.1(I1)
N$169: IC19.6(B:O) U$8.2(I2)
N$170: IC19.8(C:O) U$8.3(I3)
N$171: IC20.11(D:O) U$8.8(I8)
N$172: IC20.8(C:O) U$8.7(I7)
N$173: IC20.6(B:O) U$8.6(I6)
N$174: IC20.3(A:O) U$8.5(I5)
N$175: IC19.11(D:O) U$8.4(I4)
N$176: IC3.23(2Q8) IC15.12(D:I0) IC16.47(1D1)
N$179: U$5.18(O1) X1.1
N$180: U$5.17(O2) X1.3
N$181: U$5.16(O3) X1.5
N$182: U$5.15(O4) X1.7
N$183: U$5.14(O5) X1.9
N$184: U$5.13(O6) X1.11
N$185: U$5.12(O7) X1.13
N$186: U$5.11(O8) X1.15
N$187: U$6.18(O1) X1.17
N$188: U$6.17(O2) X1.19
N$189: U$6.16(O3) X1.21
N$190: U$6.15(O4) X1.23
N$191: U$6.14(O5) X1.25
N$192: U$6.13(O6) X1.27
N$193: U$6.12(O7) X1.29
N$194: U$6.11(O8) X1.31
N$195: U$8.11(O8) X1.32
N$196: U$8.12(O7) X1.30
N$197: U$8.13(O6) X1.28
N$198: U$8.14(O5) X1.26
N$199: U$8.15(O4) X1.24
N$200: U$8.16(O3) X1.22
N$201: U$8.17(O2) X1.20
N$202: U$8.18(O1) X1.18
N$203: U$7.11(O8) X1.16
N$204: U$7.12(O7) X1.14
N$205: U$7.13(O6) X1.12
N$206: U$7.14(O5) X1.10
N$207: U$7.15(O4) X1.8
N$208: U$7.16(O3) X1.6
N$209: U$7.17(O2) X1.4
N$210: U$7.18(O1) X1.2
N$212: IC21.2(1Q1) IC21.46(1D2) IC22.1(A:I0)
N$213: IC21.3(1Q2) IC21.44(1D3) IC22.4(B:I0)
N$214: IC21.5(1Q3) IC21.43(1D4) IC22.9(C:I0)
N$215: IC21.6(1Q4) IC21.41(1D5) IC22.12(D:I0)
N$216: IC21.8(1Q5) IC21.40(1D6) IC23.1(A:I0)
N$217: IC21.9(1Q6) IC21.38(1D7) IC23.4(B:I0)
N$218: IC21.11(1Q7) IC21.37(1D8) IC23.9(C:I0)
N$219: IC21.12(1Q8) IC21.36(2D1) IC23.12(D:I0)
N$220: IC21.13(2Q1) IC21.35(2D2) IC24.1(A:I0)
N$221: IC21.14(2Q2) IC21.33(2D3) IC24.4(B:I0)
N$222: IC21.16(2Q3) IC21.32(2D4) IC24.9(C:I0)
N$223: IC21.17(2Q4) IC21.30(2D5) IC24.12(D:I0)
N$224: IC21.19(2Q5) IC21.29(2D6) IC25.1(A:I0)
N$225: IC21.20(2Q6) IC21.27(2D7) IC25.4(B:I0)
N$226: IC21.22(2Q7) IC21.26(2D8) IC25.9(C:I0)
N$228: IC22.3(A:O) U$9.1(I1)
N$229: IC22.6(B:O) U$9.2(I2)
N$230: IC22.8(C:O) U$9.3(I3)
N$231: IC22.11(D:O) U$9.4(I4)
N$232: IC23.3(A:O) U$9.5(I5)
N$233: IC23.11(D:O) U$9.8(I8)
N$234: IC23.8(C:O) U$9.7(I7)
N$235: IC23.6(B:O) U$9.6(I6)
N$236: IC24.3(A:O) U$10.1(I1)
N$237: IC24.6(B:O) U$10.2(I2)
N$238: IC24.8(C:O) U$10.3(I3)
N$239: IC25.11(D:O) U$10.8(I8)
N$240: IC25.8(C:O) U$10.7(I7)
N$241: IC25.6(B:O) U$10.6(I6)
N$242: IC25.3(A:O) U$10.5(I5)
N$243: IC24.11(D:O) U$10.4(I4)
N$244: IC21.47(1D1) X11.4
N$248: IC26.2(1Q1) IC26.46(1D2) IC27.1(A:I0)
N$249: IC26.3(1Q2) IC26.44(1D3) IC27.4(B:I0)
N$250: IC26.5(1Q3) IC26.43(1D4) IC27.9(C:I0)
N$251: IC26.6(1Q4) IC26.41(1D5) IC27.12(D:I0)
N$252: IC26.8(1Q5) IC26.40(1D6) IC28.1(A:I0)
N$253: IC26.9(1Q6) IC26.38(1D7) IC28.4(B:I0)
N$254: IC26.11(1Q7) IC26.37(1D8) IC28.9(C:I0)
N$255: IC26.12(1Q8) IC26.36(2D1) IC28.12(D:I0)
N$256: IC26.13(2Q1) IC26.35(2D2) IC29.1(A:I0)
N$257: IC26.14(2Q2) IC26.33(2D3) IC29.4(B:I0)
N$258: IC26.16(2Q3) IC26.32(2D4) IC29.9(C:I0)
N$259: IC26.17(2Q4) IC26.30(2D5) IC29.12(D:I0)
N$260: IC26.19(2Q5) IC26.29(2D6) IC30.1(A:I0)
N$261: IC26.20(2Q6) IC26.27(2D7) IC30.4(B:I0)
N$262: IC26.22(2Q7) IC26.26(2D8) IC30.9(C:I0)
N$263: IC3.47(1D1) IC26.23(2Q8) IC30.12(D:I0)
N$265: IC27.3(A:O) U$11.1(I1)
N$266: IC27.6(B:O) U$11.2(I2)
N$267: IC27.8(C:O) U$11.3(I3)
N$268: IC27.11(D:O) U$11.4(I4)
N$269: IC28.3(A:O) U$11.5(I5)
N$270: IC28.11(D:O) U$11.8(I8)
N$271: IC28.8(C:O) U$11.7(I7)
N$272: IC28.6(B:O) U$11.6(I6)
N$273: IC29.3(A:O) U$12.1(I1)
N$274: IC29.6(B:O) U$12.2(I2)
N$275: IC29.8(C:O) U$12.3(I3)
N$276: IC30.11(D:O) U$12.8(I8)
N$277: IC30.8(C:O) U$12.7(I7)
N$278: IC30.6(B:O) U$12.6(I6)
N$279: IC30.3(A:O) U$12.5(I5)
N$280: IC29.11(D:O) U$12.4(I4)
N$281: IC21.23(2Q8) IC25.12(D:I0) IC26.47(1D1)
N$284: U$9.18(O1) X3.1
N$285: U$9.17(O2) X3.3
N$286: U$9.16(O3) X3.5
N$287: U$9.15(O4) X3.7
N$288: U$9.14(O5) X3.9
N$289: U$9.13(O6) X3.11
N$290: U$9.12(O7) X3.13
N$291: U$9.11(O8) X3.15
N$292: U$10.18(O1) X3.17
N$293: U$10.17(O2) X3.19
N$294: U$10.16(O3) X3.21
N$295: U$10.15(O4) X3.23
N$296: U$10.14(O5) X3.25
N$297: U$10.13(O6) X3.27
N$298: U$10.12(O7) X3.29
N$299: U$10.11(O8) X3.31
N$300: U$12.11(O8) X3.32
N$301: U$12.12(O7) X3.30
N$302: U$12.13(O6) X3.28
N$303: U$12.14(O5) X3.26
N$304: U$12.15(O4) X3.24
N$305: U$12.16(O3) X3.22
N$306: U$12.17(O2) X3.20
N$307: U$12.18(O1) X3.18
N$308: U$11.11(O8) X3.16
N$309: U$11.12(O7) X3.14
N$310: U$11.13(O6) X3.12
N$311: U$11.14(O5) X3.10
N$312: U$11.15(O4) X3.8
N$313: U$11.16(O3) X3.6
N$314: U$11.17(O2) X3.4
N$315: U$11.18(O1) X3.2
N$376: IC12.2(A:I1) IC12.5(B:I1) IC12.10(C:I1) IC12.13(D:I1) IC13.2(A:I1) IC13.5(B:I1) IC13.10(C:I1) IC13.13(D:I1) IC101.17(2Q4) X11.2
N$938: IC27.2(A:I1) IC27.5(B:I1) IC27.10(C:I1) IC27.13(D:I1) IC28.2(A:I1) IC28.5(B:I1) IC28.10(C:I1) IC28.13(D:I1) IC101.5(1Q3) IC101.43(1D4)
N$1006: IC29.2(A:I1) IC29.5(B:I1) IC29.10(C:I1) IC29.13(D:I1) IC30.2(A:I1) IC30.5(B:I1) IC30.10(C:I1) IC30.13(D:I1) IC101.6(1Q4) IC101.41(1D5)
N$1008: IC7.2(A:I1) IC7.5(B:I1) IC7.10(C:I1) IC7.13(D:I1) IC10.2(A:I1) IC10.5(B:I1) IC10.10(C:I1) IC10.13(D:I1) IC101.8(1Q5) IC101.40(1D6)
N$1009: IC14.2(A:I1) IC14.5(B:I1) IC14.10(C:I1) IC14.13(D:I1) IC15.2(A:I1) IC15.5(B:I1) IC15.10(C:I1) IC15.13(D:I1) IC101.9(1Q6) IC101.38(1D7)
N$1010: IC17.2(A:I1) IC17.5(B:I1) IC17.10(C:I1) IC17.13(D:I1) IC18.2(A:I1) IC18.5(B:I1) IC18.10(C:I1) IC18.13(D:I1) IC101.11(1Q7) IC101.37(1D8)
N$1011: IC19.2(A:I1) IC19.5(B:I1) IC19.10(C:I1) IC19.13(D:I1) IC20.2(A:I1) IC20.5(B:I1) IC20.10(C:I1) IC20.13(D:I1) IC101.12(1Q8) IC101.36(2D1)
N$1012: IC2.2(A:I1) IC2.5(B:I1) IC2.10(C:I1) IC2.13(D:I1) IC4.2(A:I1) IC4.5(B:I1) IC4.10(C:I1) IC4.13(D:I1) IC101.13(2Q1) IC101.35(2D2)
N$1013: IC5.2(A:I1) IC5.5(B:I1) IC5.10(C:I1) IC5.13(D:I1) IC6.2(A:I1) IC6.5(B:I1) IC6.10(C:I1) IC6.13(D:I1) IC101.14(2Q2) IC101.33(2D3)
N$1014: IC9.2(A:I1) IC9.5(B:I1) IC9.10(C:I1) IC9.13(D:I1) IC11.2(A:I1) IC11.5(B:I1) IC11.10(C:I1) IC11.13(D:I1) IC101.16(2Q3) IC101.32(2D4)
N$1020: IC101.47(1D1) X11.3
N$1021: U$1.10(CD+) U$2.10(CD+) U$3.10(CD+) U$4.10(CD+) U$5.10(CD+) U$6.10(CD+) U$7.10(CD+) U$8.10(CD+) U$9.10(CD+) U$10.10(CD+) U$11.10(CD+) U$12.10(CD+) X11.7
N$1060: IC101.25(2CLK) IC101.48(1CLK) X11.6
N$1061: IC1.25(2CLK) IC1.48(1CLK) IC3.25(2CLK) IC3.48(1CLK) IC8.25(2CLK) IC8.48(1CLK) IC16.25(2CLK) IC16.48(1CLK) IC21.25(2CLK) IC21.48(1CLK) IC26.25(2CLK) IC26.48(1CLK) X11.5
TRIG_RETURN: IC8.23(2Q8) IC13.12(D:I0) X11.1
VCC: X11.8
Unconnected: IC101.19(2Q5) IC101.20(2Q6) IC101.22(2Q7) IC101.23(2Q8) IC101.26(2D8) IC101.27(2D7) IC101.29(2D6) IC101.30(2D5) X11.10 X11.11 X11.12 X11.13 X11.14

## Power pins joined to a net without a drawn wire
GND: IC1.4(GND) IC1.10(GND) IC1.15(GND) IC1.21(GND) IC1.28(GND) IC1.34(GND) IC1.39(GND) IC1.45(GND) IC2.7(P:GND) IC3.4(GND) IC3.10(GND) IC3.15(GND) IC3.21(GND) IC3.28(GND) IC3.34(GND) IC3.39(GND) IC3.45(GND) IC4.7(P:GND) IC5.7(P:GND) IC6.7(P:GND) IC7.7(P:GND) IC8.4(GND) IC8.10(GND) IC8.15(GND) IC8.21(GND) IC8.28(GND) IC8.34(GND) IC8.39(GND) IC8.45(GND) IC9.7(P:GND) IC10.7(P:GND) IC11.7(P:GND) IC12.7(P:GND) IC13.7(P:GND) IC14.7(P:GND) IC15.7(P:GND) IC16.4(GND) IC16.10(GND) IC16.15(GND) IC16.21(GND) IC16.28(GND) IC16.34(GND) IC16.39(GND) IC16.45(GND) IC17.7(P:GND) IC18.7(P:GND) IC19.7(P:GND) IC20.7(P:GND) IC21.4(GND) IC21.10(GND) IC21.15(GND) IC21.21(GND) IC21.28(GND) IC21.34(GND) IC21.39(GND) IC21.45(GND) IC22.7(P:GND) IC23.7(P:GND) IC24.7(P:GND) IC25.7(P:GND) IC26.4(GND) IC26.10(GND) IC26.15(GND) IC26.21(GND) IC26.28(GND) IC26.34(GND) IC26.39(GND) IC26.45(GND) IC27.7(P:GND) IC28.7(P:GND) IC29.7(P:GND) IC30.7(P:GND) IC101.4(GND) IC101.10(GND) IC101.15(GND) IC101.21(GND) IC101.28(GND) IC101.34(GND) IC101.39(GND) IC101.45(GND)
VCC: IC1.7(VCC) IC1.18(VCC) IC1.31(VCC) IC1.42(VCC) IC2.14(P:VCC) IC3.7(VCC) IC3.18(VCC) IC3.31(VCC) IC3.42(VCC) IC4.14(P:VCC) IC5.14(P:VCC) IC6.14(P:VCC) IC7.14(P:VCC) IC8.7(VCC) IC8.18(VCC) IC8.31(VCC) IC8.42(VCC) IC9.14(P:VCC) IC10.14(P:VCC) IC11.14(P:VCC) IC12.14(P:VCC) IC13.14(P:VCC) IC14.14(P:VCC) IC15.14(P:VCC) IC16.7(VCC) IC16.18(VCC) IC16.31(VCC) IC16.42(VCC) IC17.14(P:VCC) IC18.14(P:VCC) IC19.14(P:VCC) IC20.14(P:VCC) IC21.7(VCC) IC21.18(VCC) IC21.31(VCC) IC21.42(VCC) IC22.14(P:VCC) IC23.14(P:VCC) IC24.14(P:VCC) IC25.14(P:VCC) IC26.7(VCC) IC26.18(VCC) IC26.31(VCC) IC26.42(VCC) IC27.14(P:VCC) IC28.14(P:VCC) IC29.14(P:VCC) IC30.14(P:VCC) IC101.7(VCC) IC101.18(VCC) IC101.31(VCC) IC101.42(VCC)

## Library data of the parts
IC1 IC3 IC8 IC16 IC21 IC26 IC101 = 74ac-logic:74AC16374: 16-bit edge-triggered D-type FLIP FLOP, 3-state
IC2 IC4-IC7 IC9-IC15 IC17-IC20 IC22-IC25 IC27-IC30 = 74xx-us:74*08: Quad 2-input AND gate
U$1-U$12 = fairchild-semic:ULN2804-SM: ULN2804 is a high voltage, high current Darlington array comprised of eight NPN Darlington pairs. The device features open-collector outputs with suppression diodes for inductive loads and is ideally suited for interfacing between low-level logic circuitry and high power loads.
X1-X3 = con-molex:87758-3216: 32 Pin - 2mm Dual Row Single Wafer, Vertical T/H HDR Source: http://www.molex.com/pdm_docs/sd/877580616_sd.pdf; MPN: 87758-3216; OC_FARNELL: unknown; OC_NEWARK: 25M5684
X11 = con-molex:87758-1416: 14 Pin - 2mm Dual Row Single Wafer, Vertical T/H HDR Source: http://www.molex.com/pdm_docs/sd/877580616_sd.pdf; MF: MOLEX; MPN: 87758-1416; OC_FARNELL: 7472358; OC_NEWARK: 59J1562